# Altium project PCB_Project1.PrjPCB
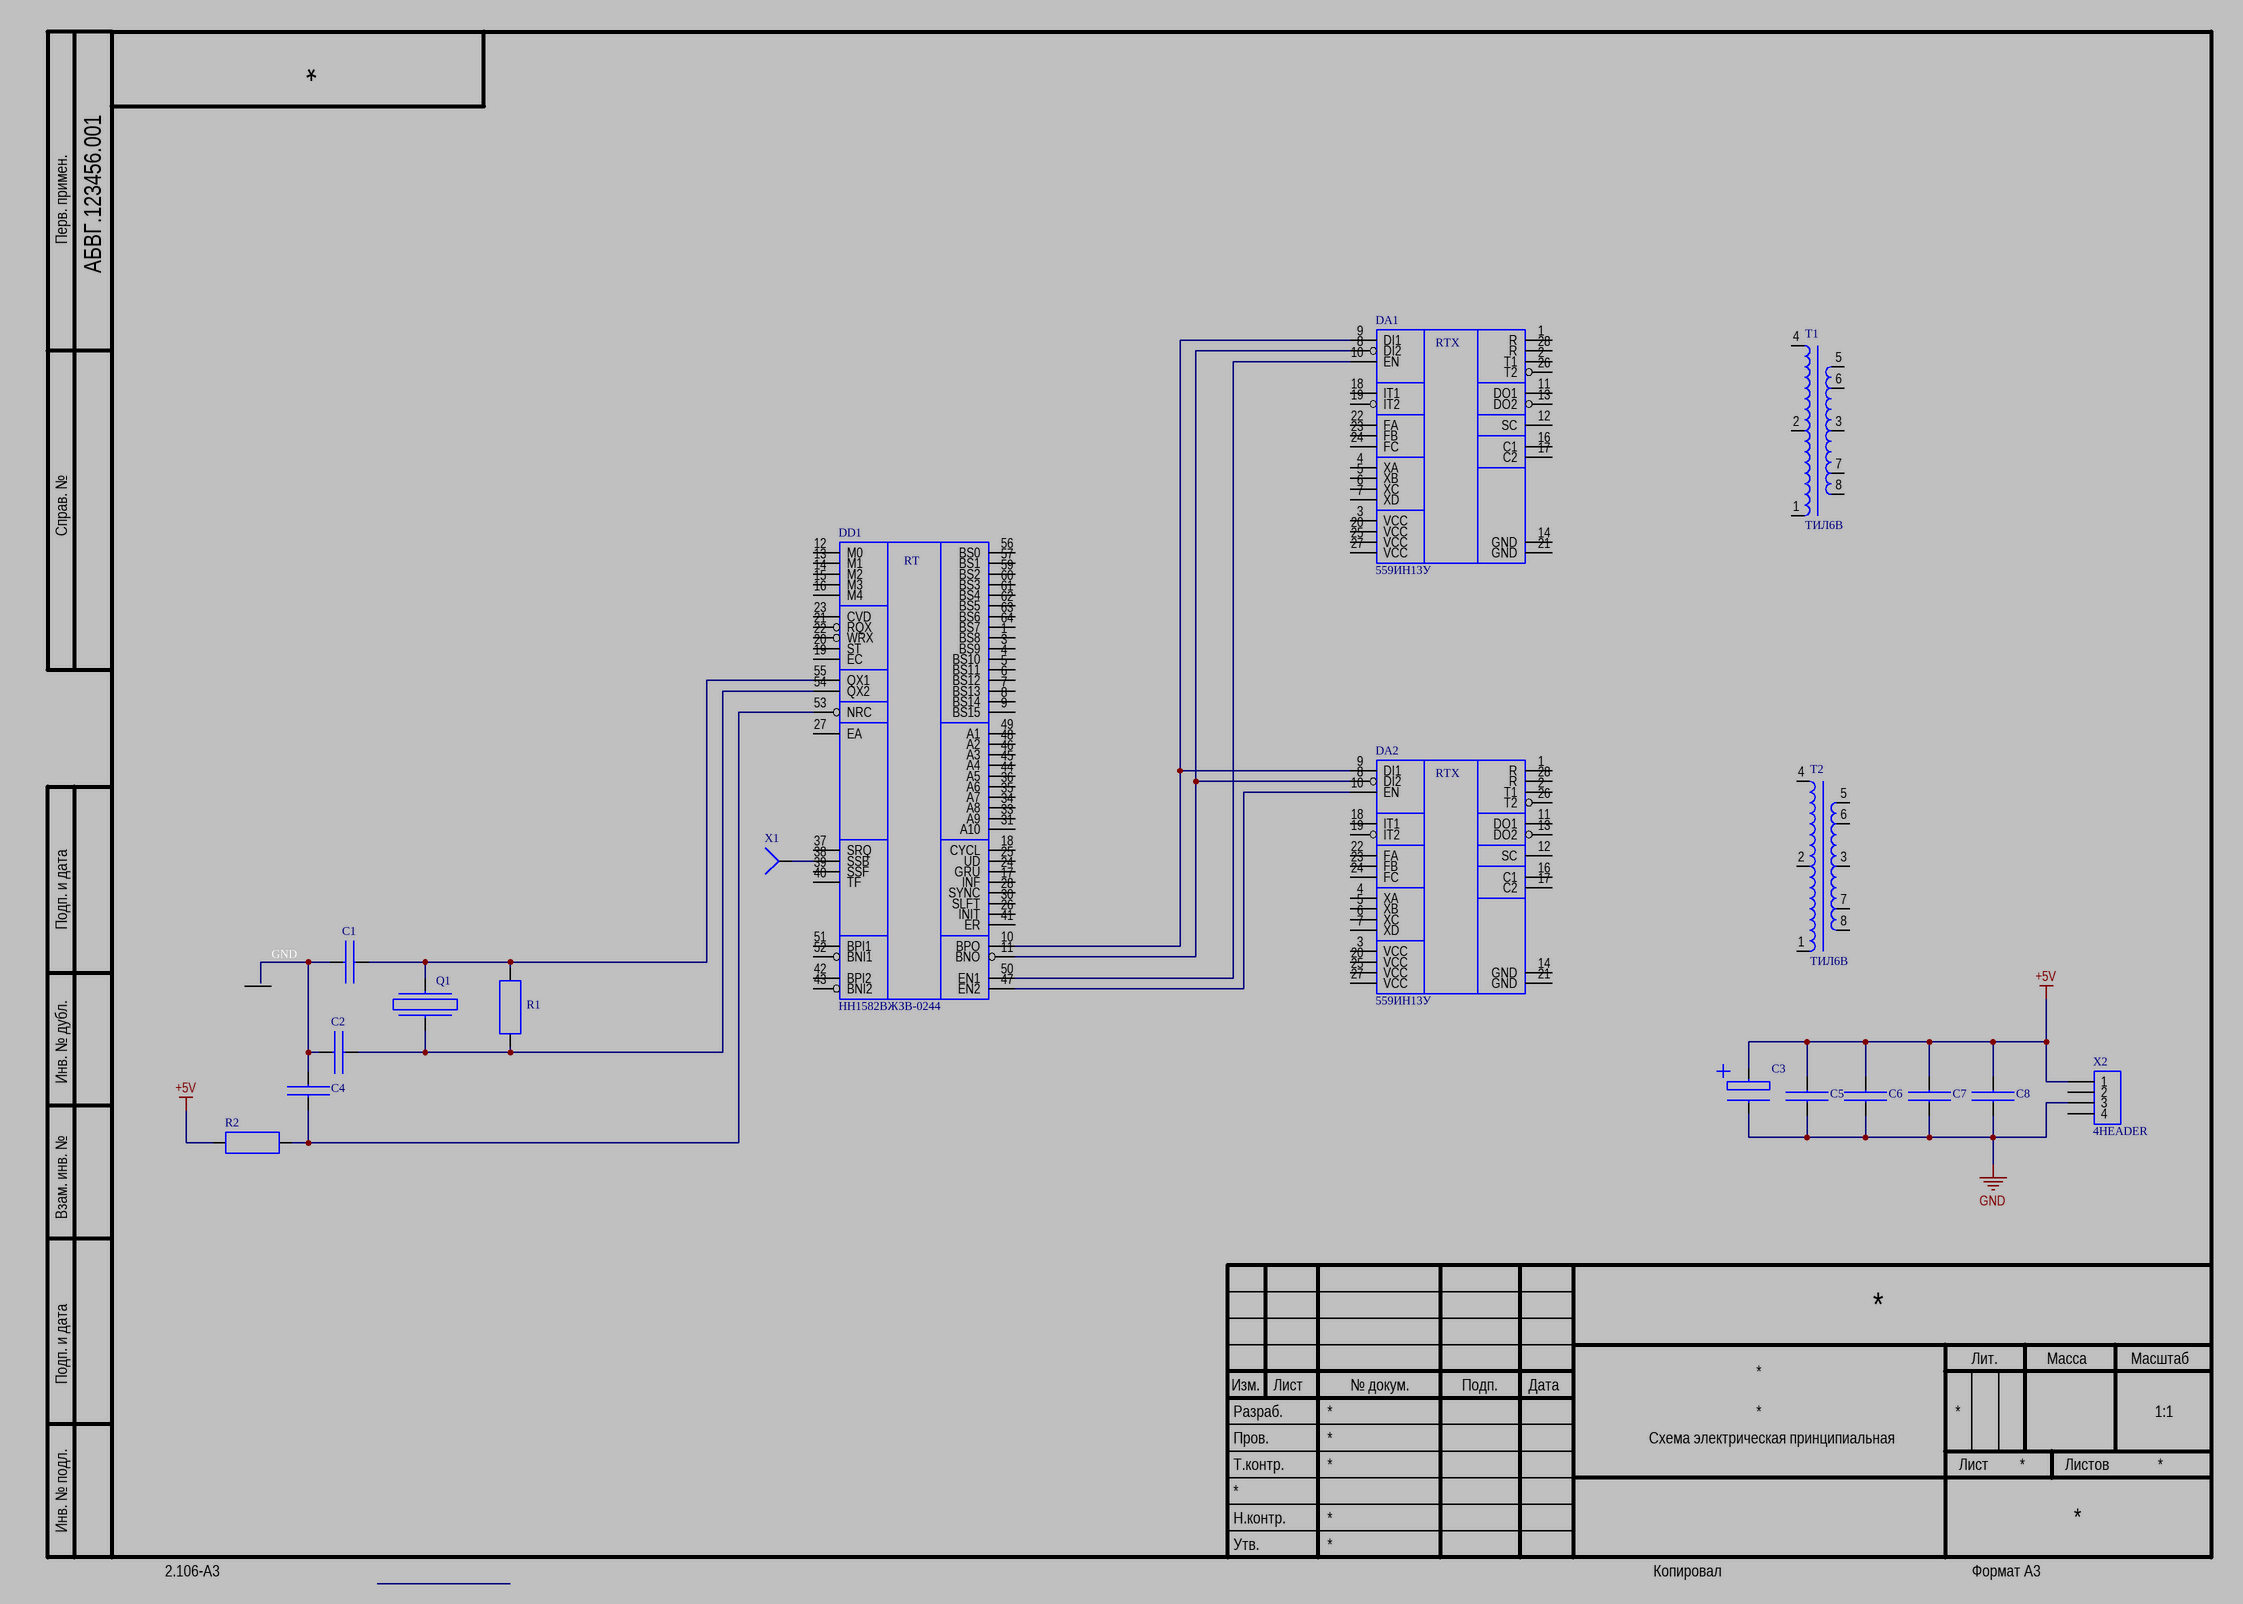
[diagram p0: Sheet1.SchDoc]
1 sheet, 18 parts. Net scope: global (net labels, ports and power ports of the same name join across sheets).

## Sheet Sheet1.SchDoc
size 420 x 297 mm; PageSetup: Record=PageOptions|CenterHorizontal=True|CenterVertical=True|PrintScale=0.94|XCorrection=1.00|YCorrection=1.00|PrintKind=1|BorderSize=5000000|LeftOffset=0|BottomOffset=0|Orientation=1|PaperLength=1000|PaperWidth=1000|Scale=100|PaperSource=7|PrintQuality=-4|MediaType=1|DitherType=10|PaperKind=A4|PrintScaleMode=1; MainDevice: Перв.примен.; Scale: 1:1; DocumentType: Схема электрическая принципиальная; FirstReferrence: АБВГ.123456.001

### Parts
C1  C_2  (value not drawn)
C2  C_2  (value not drawn)
C3  C_3  (value not drawn)
C4  C_2  (value not drawn)
C5  C_2  (value not drawn)
C6  C_2  (value not drawn)
C7  C_2  (value not drawn)
C8  C_2  (value not drawn)
DA1  559ИН13У  [H09.28-1B]
DA2  559ИН13У  [H09.28-1B]
DD1  НН1582ВЖЗВ-0244  [H18.64-1B]
Q1  Q_1  (value not drawn)
R1  R_1  (value not drawn)
R2  100k  (value not drawn)
T1  ТИЛ6B
T2  ТИЛ6B
X1  X_5  (value not drawn)
X2  4HEADER

### Nets
+5V: C3.1 C5.2 C6.2 C7.2 C8.2 R2.1 X2.1
GND: C1.1 C2.1 C3.2 C4.2 C5.1 C6.1 C7.1 C8.1 X2.3
NetC1_2: C1.2 DD1.55(QX1) Q1.2 R1.2
NetC2_2: C2.2 DD1.54(QX2) Q1.1 R1.1
NetC4_1: C4.1 DD1.53(NRC) R2.2
NetDA1_8: DA1.8(DI2) DA2.8(DI2) DD1.11(BNO)
NetDA1_9: DA1.9(DI1) DA2.9(DI1) DD1.10(BPO)
NetDA1_10: DA1.10(EN) DD1.50(EN1)
NetDA2_10: DA2.10(EN) DD1.47(EN2)
NetDD1_38: DD1.38(SSB) X1.1

Not connected (* = marked no-connect by the designer): DA1 1(R) 2(T1) 3(VCC) 4(XA) 5(XB) 6(XC) 7(XD) 11(DO1) 12(SC) 13(DO2) 14(GND) 16(C1) 17(C2) 18(IT1) 19(IT2) 20(VCC) 21(GND) 22(FA) 23(FB) 24(FC) 25(VCC) 26(T2) 27(VCC) 28(R); DA2 1(R) 2(T1) 3(VCC) 4(XA) 5(XB) 6(XC) 7(XD) 11(DO1) 12(SC) 13(DO2) 14(GND) 16(C1) 17(C2) 18(IT1) 19(IT2) 20(VCC) 21(GND) 22(FA) 23(FB) 24(FC) 25(VCC) 26(T2) 27(VCC) 28(R); DD1 1(BS8) 3(BS9) 4(BS10) 5(BS11) 6(BS12) 7(BS13) 8(BS14) 9(BS15) 12(M0) 13(M1) 14(M2) 15(M3) 16(M4) 17(INF) 18(CYCL) 19(EC) 20(ST) 21(RQX) 22(WRX) 23(CVD) 24(GRU) 25(UD) 26(INIT) 27(EA) 28(SYNC) 30(SLFT) 31(A10) 33(A9) 34(A8) 35(A7) 36(A6) 37(SRQ) 39(SSF) 40(TF) 41(ER) 42(BPI2) 43(BNI2) 44(A5) 45(A4) 46(A3) 48(A2) 49(A1) 51(BPI1) 52(BNI1) 56(BS0) 57(BS1) 59(BS2) 60(BS3) 61(BS4) 62(BS5) 63(BS6) 64(BS7); T1 1 2 3 4 5 6 7 8; T2 1 2 3 4 5 6 7 8; X2 2 4

### Notes on the sheet
- Перв. примен.
- Справ. №
- Подп. и дата
- Инв. № дубл.
- Взам. инв. №
- Разраб.
- Изм.
- Лист
- № докум.
- Подп.
- Дата
- Лит.
- Масса
- Масштаб
- Пров.
- Т.контр.
- Листов
- Инв. № подл.
- Утв.
- Н.контр.
- 2.106-A3
- Копировал
- Формат А3
- (in symbol 559ИН13У) RTX
- (in symbol НН1582ВЖЗВ-0244) RT

### Library data of the parts
R2 = R_1